# EAGLE design MicroPumpPCB (EAGLE 9.6.0)
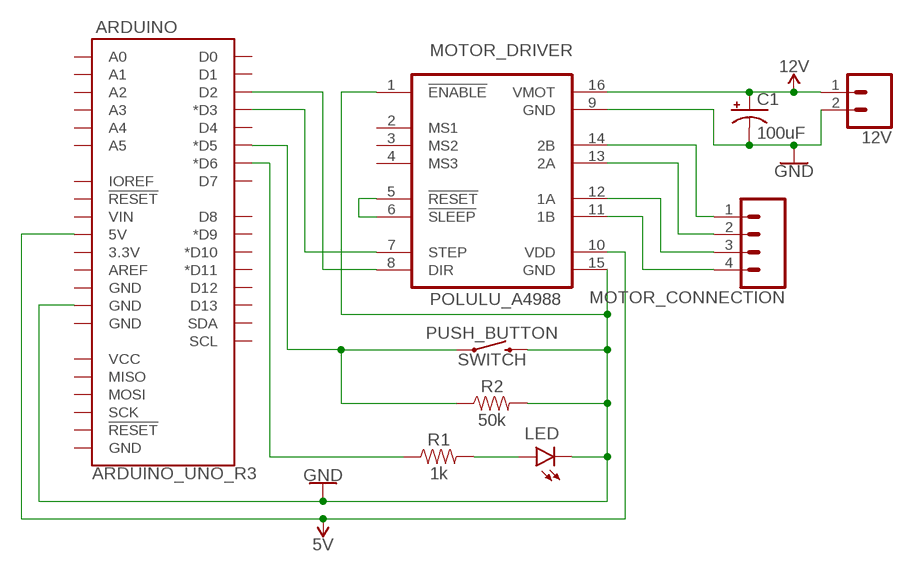
[diagram p0: schematic, sheet 1]

## Parts
12V  CONN_02POLAR  [MOLEX-1X2]
ARDUINO  ARDUINO_UNO_R3  [ARDUINO_R3]
C1  100uF  100UF-POLAR-RADIAL-2.5MM-25V-20%  [CPOL-RADIAL-2.5MM-6.5MM]
LED  LED5MM  [LED_5MM]
MOTOR_CONNECTION  CONN_04  [1X04]
POLULU_A4988  MOTOR_DRIVER  POLOLULU2128  [POLOLULU2128]
PUSH_BUTTON  SWITCH  MOMENTARY-SWITCH-SPST-PTH-6.0MM  [TACTILE_SWITCH_PTH_6.0MM]
R1  1k  1KOHM-HORIZ-1/4W-1%  [AXIAL-0.3]
R2  50k  1KOHM-HORIZ-1/4W-1%  [AXIAL-0.3]

## Nets
5V: ARDUINO.5V POLULU_A4988.10(VDD)
12V: 12V.1 C1.1(+) POLULU_A4988.16(VMOT)
GND: 12V.2 ARDUINO.GND@3(GND) C1.2(-) LED.K(C) POLULU_A4988.1(!ENABLE) POLULU_A4988.9(GND) POLULU_A4988.15(GND) PUSH_BUTTON.3 R2.P$2
N$1: ARDUINO.D2 POLULU_A4988.8(DIR)
N$2: ARDUINO.D3(*D3) POLULU_A4988.7(STEP)
N$3: MOTOR_CONNECTION.1 POLULU_A4988.14(2B)
N$4: MOTOR_CONNECTION.2 POLULU_A4988.13(2A)
N$5: MOTOR_CONNECTION.3 POLULU_A4988.12(1A)
N$6: MOTOR_CONNECTION.4 POLULU_A4988.11(1B)
N$7: ARDUINO.D6(*D6) R1.P$1
N$8: LED.A R1.P$2
N$9: ARDUINO.D5(*D5) PUSH_BUTTON.1 R2.P$1
N$10: POLULU_A4988.5(!RESET) POLULU_A4988.6(!SLEEP)
Unconnected: ARDUINO.3.3V ARDUINO.A0 ARDUINO.A1 ARDUINO.A2 ARDUINO.A3 ARDUINO.A4 ARDUINO.A5 ARDUINO.AREF ARDUINO.D0 ARDUINO.D1 ARDUINO.D4 ARDUINO.D7 ARDUINO.D8 ARDUINO.D9(*D9) ARDUINO.D10(*D10) ARDUINO.D11(*D11) ARDUINO.D12 ARDUINO.D13 ARDUINO.GND@1(GND) ARDUINO.GND@2(GND) ARDUINO.GND@4(GND) ARDUINO.IOREF ARDUINO.MISO ARDUINO.MOSI ARDUINO.RESET@1(!RESET!) ARDUINO.RESET@2(!RESET!) ARDUINO.SCK ARDUINO.SCL ARDUINO.SDA ARDUINO.VCC ARDUINO.VIN POLULU_A4988.2(MS1) POLULU_A4988.3(MS2) POLULU_A4988.4(MS3)

## Library data of the parts
12V = SparkFun-Connectors:CONN_02: Multi connection point. Often used as Generic Header-pin footprint for 0.1 inch spaced/style header connections On any of the 0.1 inch spaced packages, you can populate with these: Break Away Headers - Straight <https://www.sparkfun.com/products/116> (PRT-00116) Break Away Male Headers - Right Angle <https://www.sparkfun.com/products/553> (PRT-00553) Female Headers <https://www.sparkfun.com/products/115> (PRT-00115) Break Away Headers - Machine Pin <https://www.sparkfun.com/products/117> (PRT-00117) Break Away Female Headers - Swiss Machine Pin <https://www.sparkfun.com/products/743> (PRT-00743) For SCREWTERMINALS and SPRING TERMINALS visit here: Screw Terimnals on SparkFun.com <https://www.sparkfun.com/search/results?term=Screw+Terminals> (5mm/3.5mm/2.54mm spacing) This device is also useful as a general connection point to wire up your design to another part of your project. Our various solder wires solder well into these plated through hole pads. Hook-Up Wire - Assortment (Stranded, 22 AWG) <https://www.sparkfun.com/products/11375> (PRT-11375) Hook-Up Wire - Assortment (Solid Core, 22 AWG) <https://www.sparkfun.com/products/11367> (PRT-11367) View the entire wire category on our website here <https://www.sparkfun.com/categories/141> Special notes: Molex polarized connector foot print use with: PRT-08233 with associated crimp pins and housings. 2.54_SCREWTERM for use with PRT-10571. 3.5mm Screw Terminal footprints for PRT-08084 5mm Screw Terminal footprints for use with PRT-08432; SF_ID: PRT-09918
ARDUINO = SparkFun-Boards:ARDUINO_UNO_R3: Arduino R3 Footprint with SPI header Arduino Uno R3 Compatible Footprint. Matches PCB size of the original board. SparkFun Products: SAMD21 Dev Breakout <https://www.sparkfun.com/products/13672> RedBoard <https://www.sparkfun.com/products/12757> R3 Stackable Headers <https://www.sparkfun.com/products/11417>
C1 = SparkFun-Capacitors:100UF-POLAR: 100µF polarized capacitors A capacitor is a passive two-terminal electrical component used to store electrical energy temporarily in an electric field.; PROD_ID: CAP-08439
LED = SparkFun-LED:LED: LED (Generic) Standard schematic elements and footprints for 5mm, 3mm, 1206, and 0603 sized LEDs. Generic LEDs with no color specified.
MOTOR_CONNECTION = SparkFun-Connectors:CONN_04: Multi connection point. Often used as Generic Header-pin footprint for 0.1 inch spaced/style header connections On any of the 0.1 inch spaced packages, you can populate with these: Break Away Headers - Straight <https://www.sparkfun.com/products/116> (PRT-00116) Break Away Male Headers - Right Angle <https://www.sparkfun.com/products/553> (PRT-00553) Female Headers <https://www.sparkfun.com/products/115> (PRT-00115) Break Away Headers - Machine Pin <https://www.sparkfun.com/products/117> (PRT-00117) Break Away Female Headers - Swiss Machine Pin <https://www.sparkfun.com/products/743> (PRT-00743) For SCREWTERMINALS and SPRING TERMINALS visit here: Screw Terimnals on SparkFun.com <https://www.sparkfun.com/search/results?term=Screw+Terminals> (5mm/3.5mm/2.54mm spacing) This device is also useful as a general connection point to wire up your design to another part of your project. Our various solder wires solder well into these plated through hole pads. Hook-Up Wire - Assortment (Stranded, 22 AWG) <https://www.sparkfun.com/products/11375> (PRT-11375) Hook-Up Wire - Assortment (Solid Core, 22 AWG) <https://www.sparkfun.com/products/11367> (PRT-11367) View the entire wire category on our website here <https://www.sparkfun.com/categories/141> Special notes: Molex polarized connector foot print use with SKU : PRT-08231 with associated crimp pins and housings. 1MM SMD Version SKU: PRT-10208; PROD_ID: CONN-09696
POLULU_A4988 = stepper_drivers_etc:POLOLULU2128
PUSH_BUTTON = SparkFun-Switches:MOMENTARY-SWITCH-SPST: Momentary Switch (Pushbutton) - SPST Normally-open (NO) SPST momentary switches (buttons, pushbuttons). Variants PTH-12MM - 12mm square, through-hole Momentary Pushbutton Switch - 12mm Square <https://www.sparkfun.com/products/9190> (COM-09190) PTH-6.0MM, PTH-6.0MM-KIT - 6.0mm square, through-hole Mini Pushbutton Switch <https://www.sparkfun.com/products/97> (COM-00097) KIT package intended for soldering kit's - only one side of pads' copper is exposed. PTH-RIGHT-ANGLE-KIT - Right-angle, through-hole Right Angle Tactile Button <https://www.sparkfun.com/products/10791> - Used on SparkFun BigTime Watch Kit <https://www.sparkfun.com/products/11734> SMD-12MM - 12mm square, surface-mount Tactile Button - SMD (12mm) <https://www.sparkfun.com/products/12993> (COM-12993) Used on SparkFun PicoBoard <https://www.sparkfun.com/products/11888> SMD-4.5MM - 4.5mm Square Trackball Switch Used on SparkFun Blackberry Trackballer Breakout <https://www.sparkfun.com/products/13169> SMD-4.6MMX2.8MM - 4.60mm x 2.80mm, surface mount Used on SparkFun SAMD21 Mini Breakout <https://www.sparkfun.com/products/13664> SMD-5.2MM, SMD-5.2-REDUNDANT - 5.2mm square, surface-mount Mini Pushbutton Switch - SMD <https://www.sparkfun.com/products/8720> (COM-08720) Used on Arduino Pro Mini <https://www.sparkfun.com/products/11114> REDUNDANT package connects both switch circuits together SMD-6.0X3.5MM - 6.0 x 3.5mm, surface mount Momentary Reset Switch SMD <https://www.sparkfun.com/products/8229> (COM-08229) SMD-6.2MM-TALL - 6.2mm square, surface mount Tactile Button - SMD (6mm) <https://www.sparkfun.com/products/12992> Used on SparkFun Digital Sandbox <https://www.sparkfun.com/products/12651> SMD-RIGHT-ANGLE - Right-angle, surface mount Used on SparkFun Block for Intel® Edison - Arduino <https://www.sparkfun.com/products/13036>; PROD_ID: SWCH-08441; SF_SKU: COM-00097
R1 = SparkFun-Resistors:1KOHM: 1kΩ resistor A resistor is a passive two-terminal electrical component that implements electrical resistance as a circuit element. Resistors act to reduce current flow, and, at the same time, act to lower voltage levels within circuits. - Wikipedia; PROD_ID: RES-12182
R2 = SparkFun-Resistors:1KOHM: 1kΩ resistor A resistor is a passive two-terminal electrical component that implements electrical resistance as a circuit element. Resistors act to reduce current flow, and, at the same time, act to lower voltage levels within circuits. - Wikipedia; PROD_ID: RES-12182; VALUE: 1k

## Board
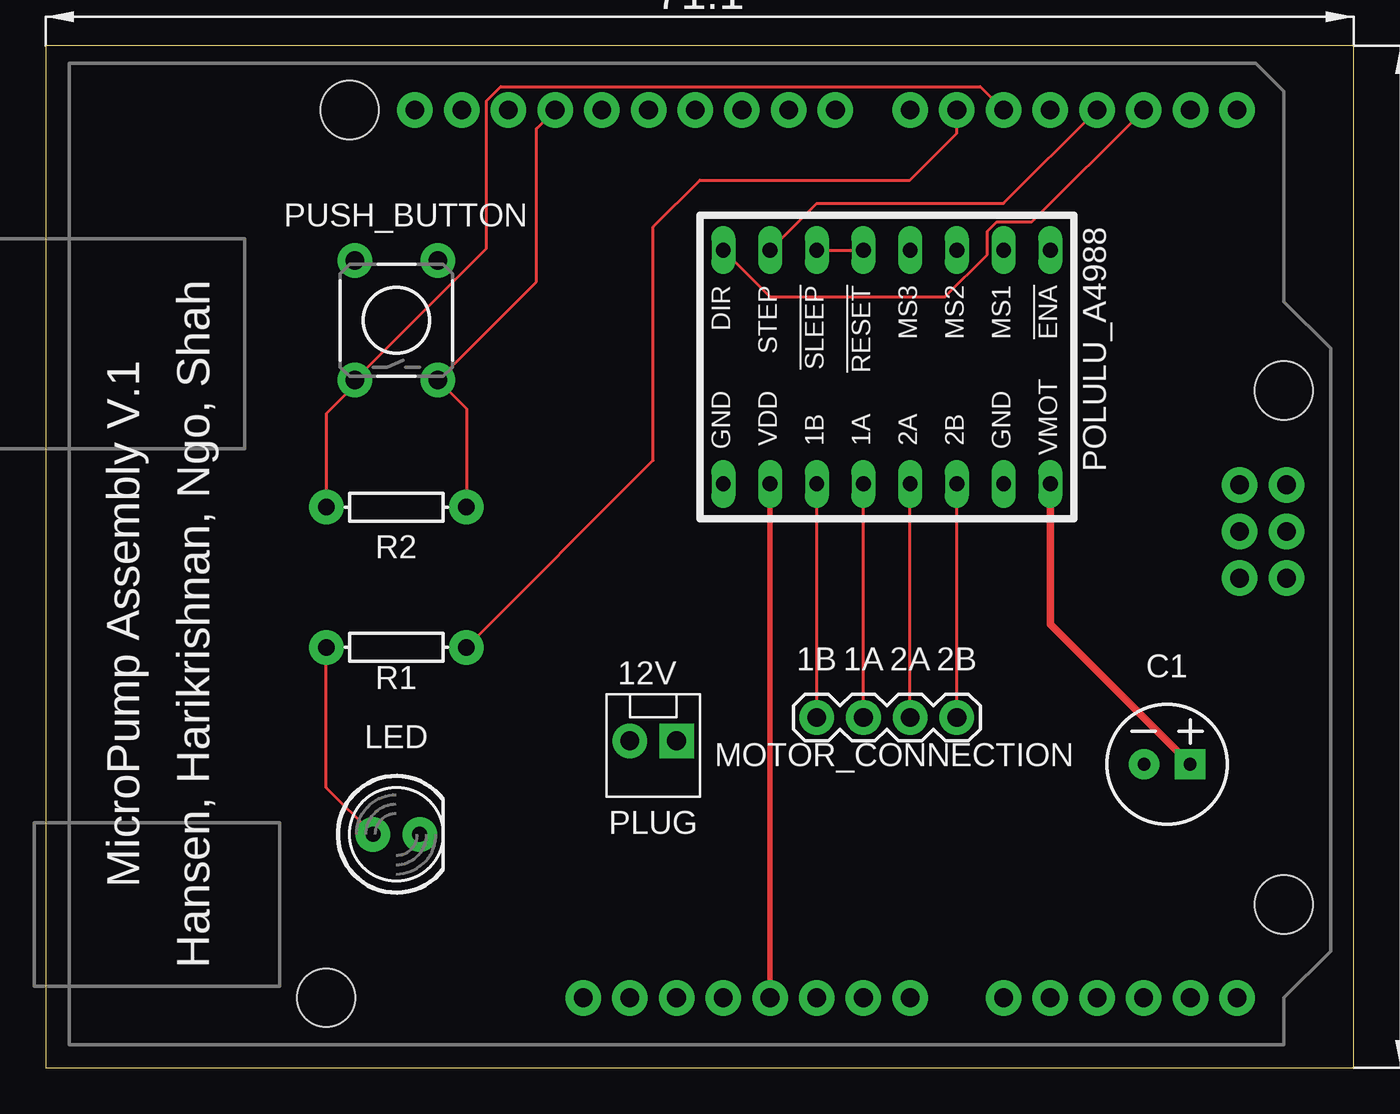
[diagram p1: board, top side]
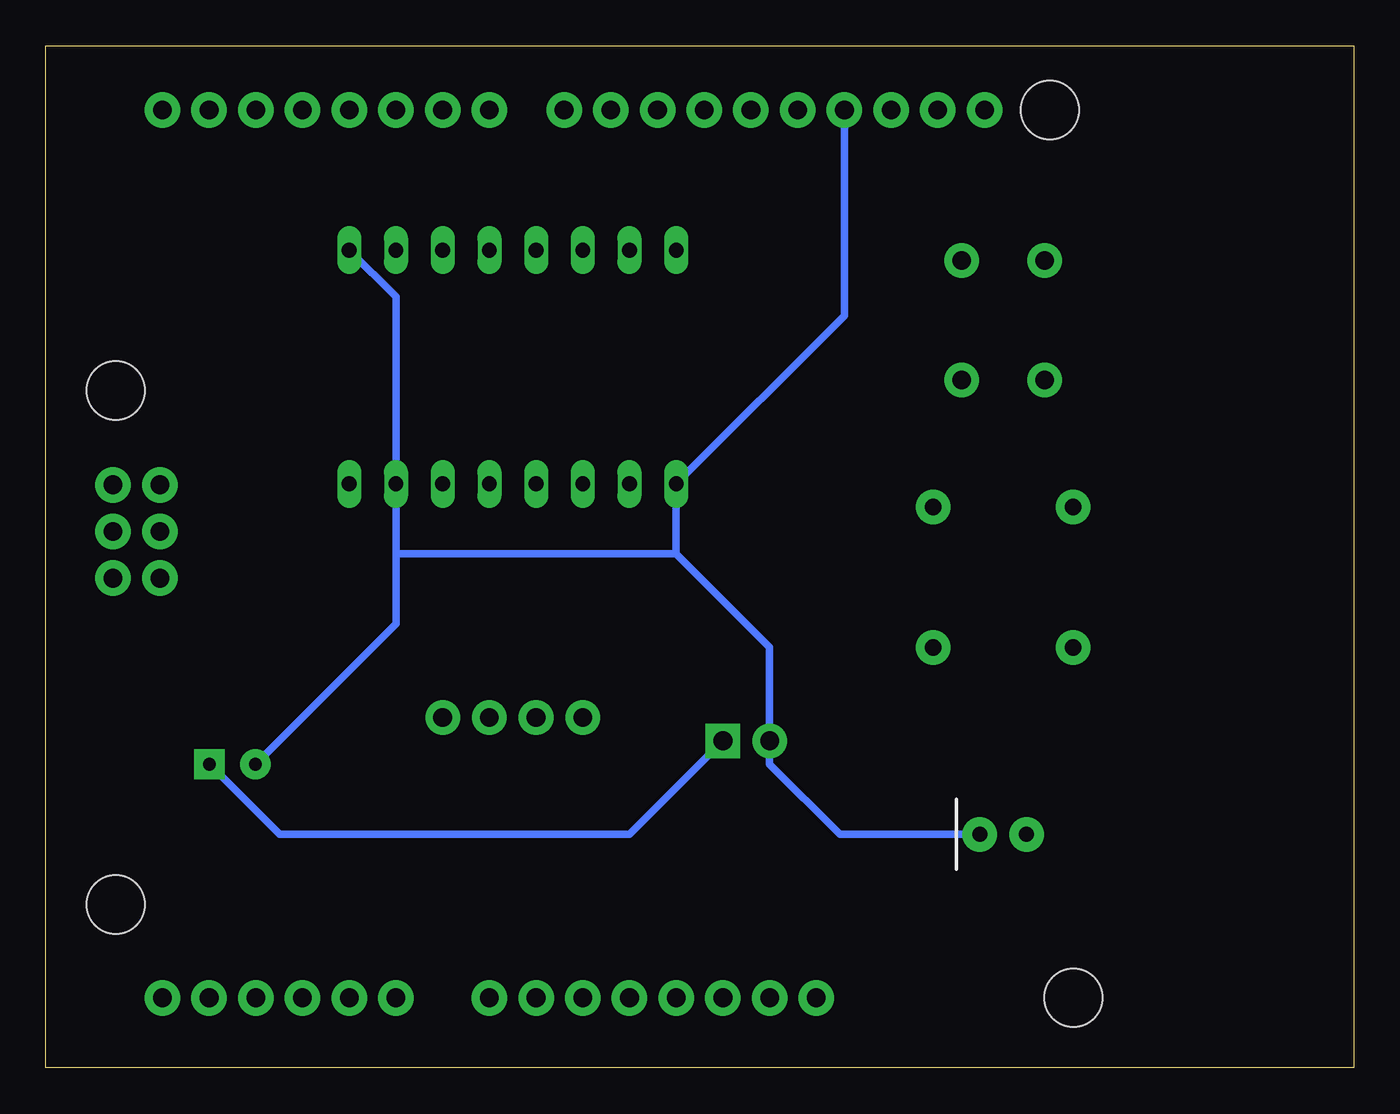
[diagram p2: board, bottom side, seen from below]

Size 71.1 x 55.55 mm. Coordinates in mm from the lower left corner, seen from the top.
Outline: 0,0 71.1,0 71.1,55.55 0,55.55 0,0
Copper layers (1*16): Top 0.035mm / dielectric 1.5mm / Bottom 0.035mm
Design rules "default": minimum track width 6mil, minimum drill 0.35mm, track to track 6mil, track to pad 6mil, pad to pad 6mil, via to via 6mil, smd to smd 6mil, copper to edge 40mil, drill to drill 6mil, minimum pad ring 10mil, minimum via ring 8mil, stop-mask expansion 4mil, vias tented up to drill 0mil, thermal gap 10mil

### Footprints (pad centres in the part's own frame; a part is rotated, then mirrored left to right if it is on the bottom)
MOLEX-1X2 = drill 1.016 pad 1.88 square: 1 0,0 | drill 1.016 pad 1.88: 2 2.54,0
ARDUINO_R3 = drill 1.016 pad 1.93: 3.3V 2.54,-24.13; 5V 5.08,-24.13; A0 17.78,-24.13; A1 20.32,-24.13; A2 22.86,-24.13; A3 25.4,-24.13; A4 27.94,-24.13; A5 30.48,-24.13; AREF -9.144,24.13; D0 30.48,24.13; D1 27.94,24.13; D2 25.4,24.13; D3 22.86,24.13; D4 20.32,24.13; D5 17.78,24.13; D6 15.24,24.13; D7 12.7,24.13; D8 8.636,24.13; D9 6.096,24.13; D10 3.556,24.13; D11 1.016,24.13; D12 -1.524,24.13; D13 -4.064,24.13; GND@1 7.62,-24.13; GND@2 10.16,-24.13; GND@3 -6.604,24.13; GND@4 33.16,-1.32; IOREF -2.54,-24.13; MISO 30.62,3.76; MOSI 33.16,1.22; NC -5.08,-24.13; RESET@1 0,-24.13; RESET@2 30.62,-1.32; SCK 30.62,1.22; SCL -14.224,24.13; SDA -11.684,24.13; VCC 33.16,3.76; VIN 12.7,-24.13 | hole 3.175: -17.78,24.13; 33.02,8.89; 33.02,-19.05; -19.05,-24.13
CPOL-RADIAL-2.5MM-6.5MM = drill 0.7 pad 1.651 square: 1 1.25,0 | drill 0.7 pad 1.651: 2 -1.25,0
LED_5MM = drill 0.813 pad 1.88: A -1.27,0; K 1.27,0
1X04 = drill 1.016 pad 1.88: 1 0,0; 2 2.54,0; 3 5.08,0; 4 7.62,0
POLOLULU2128 = drill 0.8 long: 1 -7.62,7.62; 2 -7.62,5.08; 3 -7.62,2.54; 4 -7.62,0; 5 -7.62,-2.54; 6 -7.62,-5.08; 7 -7.62,-7.62; 8 -7.62,-10.16; 9 5.08,-10.16; 10 5.08,-7.62; 11 5.08,-5.08; 12 5.08,-2.54; 13 5.08,0; 14 5.08,2.54; 15 5.08,5.08; 16 5.08,7.62
TACTILE_SWITCH_PTH_6.0MM = drill 1.016 pad 1.88: 1 -3.251,2.261; 2 3.251,2.261; 3 -3.251,-2.261; 4 3.251,-2.261
AXIAL-0.3 = drill 0.9 pad 1.88: P$1 -3.81,0; P$2 3.81,0

### Placement (x,y rotation side)
12V  34.29,17.78 180 top
ARDUINO  34.29,27.94 0 top
C1  60.96,16.51 0 top
LED  19.05,12.7 0 top
MOTOR_CONNECTION  49.53,19.05 180 top
POLULU_A4988  46.99,36.83 270 top
PUSH_BUTTON  19.05,40.64 90 top
R1  19.05,22.86 180 top
R2  19.05,30.48 0 top

### Tracks (layer width: path | path; a pad name or v marks a point on that pad's centre or on a via)
5V
  Top 0.305: ARDUINO.5V POLULU_A4988.10
12V
  Top 0.406: C1.1 62.21,16.53 54.61,24.13 POLULU_A4988.16
  Bottom 0.406: 12V.1 39.37,12.7 58.4,12.7 C1.1
GND
  Top 0.152: R2.P$2 22.86,35.84 PUSH_BUTTON.3 26.67,42.75 26.67,51.05 ARDUINO.GND@3
  Bottom 0.406: ARDUINO.GND@3 27.69,40.89 POLULU_A4988.9 36.83,27.94 | 36.83,27.94 31.75,22.86 12V.2 31.75,16.51 27.94,12.7 LED.K | C1.2 52.07,24.15 52.07,27.94 | 52.07,27.94 POLULU_A4988.15 52.07,41.91 POLULU_A4988.1 | 36.83,27.94 52.07,27.94
N$1
  Top 0.152: POLULU_A4988.8 39.37,41.91 48.89,41.91 51.19,44.2 51.19,45.47 51.7,45.99 53.61,45.99 ARDUINO.D2
N$2
  Top 0.152: POLULU_A4988.7 41.91,46.99 52.07,46.99 ARDUINO.D3
N$3
  Top 0.152: MOTOR_CONNECTION.1 POLULU_A4988.14
N$4
  Top 0.152: MOTOR_CONNECTION.2 POLULU_A4988.13
N$5
  Top 0.152: MOTOR_CONNECTION.3 POLULU_A4988.12
N$6
  Top 0.152: MOTOR_CONNECTION.4 POLULU_A4988.11
N$7
  Top 0.152: R1.P$1 33.02,33.02 33.02,45.72 35.56,48.26 46.99,48.26 49.53,50.8 ARDUINO.D6
N$8
  Top 0.152: LED.A 15.24,15.24 R1.P$2
N$9
  Top 0.152: R2.P$1 15.24,35.56 16.79,37.11 PUSH_BUTTON.1 23.95,44.55 23.95,52.56 24.73,53.34 50.8,53.34 ARDUINO.D5
N$10
  Top 0.152: POLULU_A4988.6 POLULU_A4988.5

### Text on the board
tPlace: MicroPump Assembly V.1 | Hansen, Harikrishnan, Ngo, Shah | 1B | 1A | 2A | 2B | PLUG